# EAGLE design mainboard (EAGLE 7.0.0)
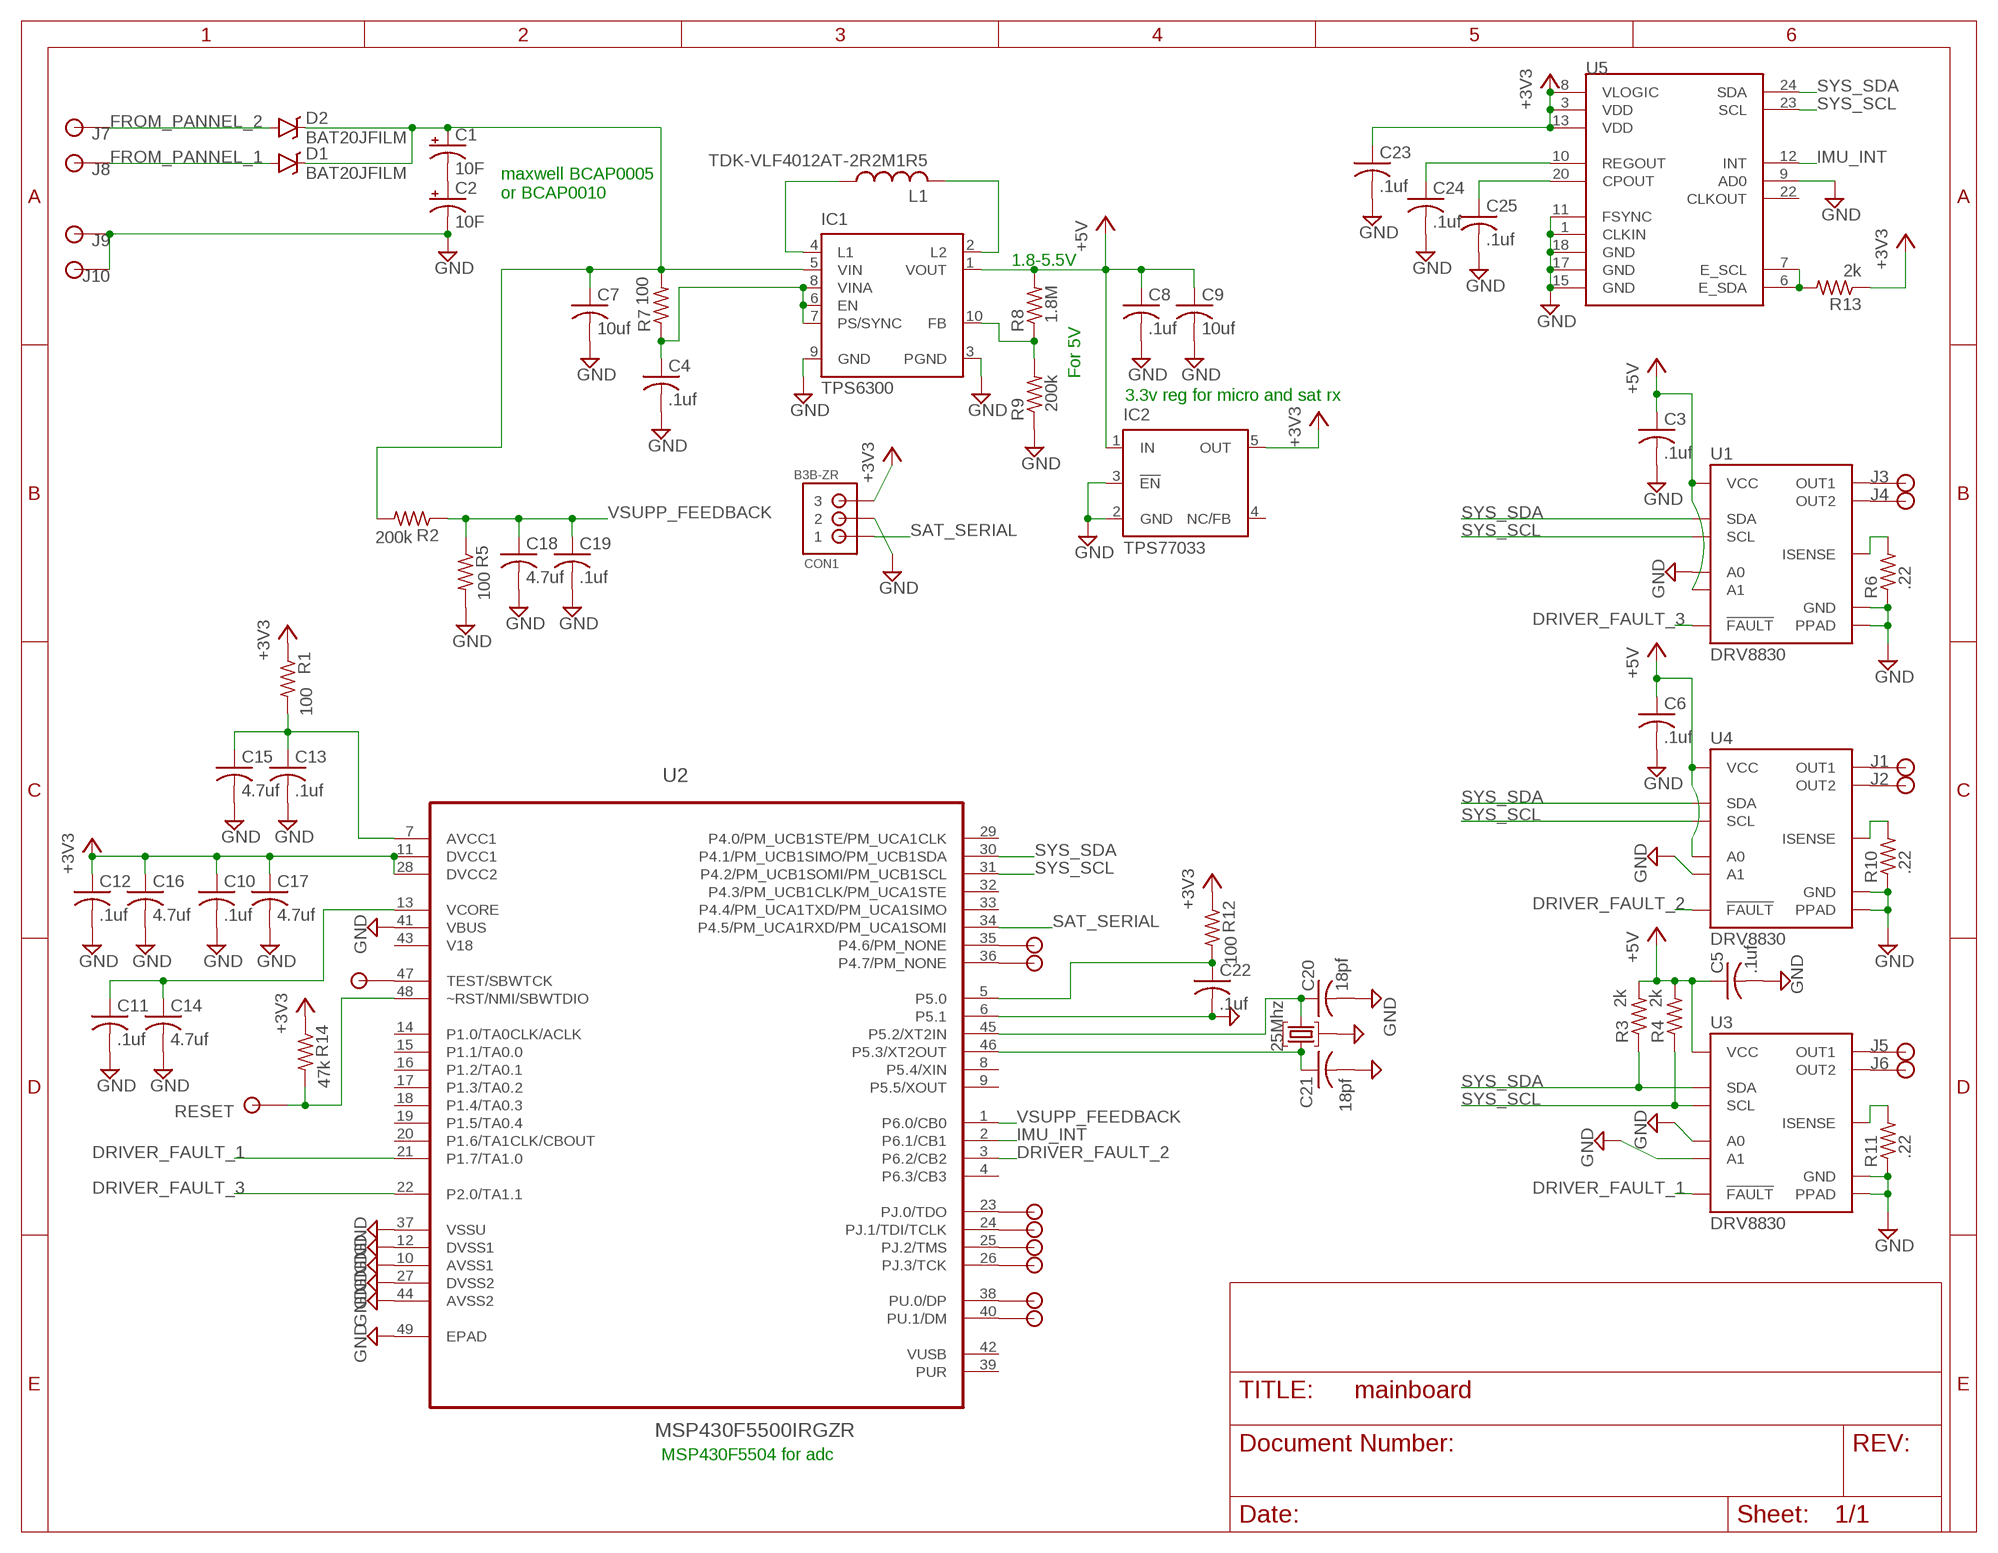
[diagram p0: schematic, sheet 1]

## Parts
C1  10F  CPOL-USE5-10.5  [E5-10,5]
C2  10F  CPOL-USE5-10.5  [E5-10,5]
C3  .1uf  C-USC0603  [C0603]
C4  .1uf  C-USC0603  [C0603]
C5  .1uf  C-USC0603  [C0603]
C6  .1uf  C-USC0603  [C0603]
C7  10uf  C-USC0603  [C0603]
C8  .1uf  C-USC0603  [C0603]
C9  10uf  C-USC0603  [C0603]
C10  .1uf  C-USC0603  [C0603]
C11  .1uf  C-USC0603  [C0603]
C12  .1uf  C-USC0603  [C0603]
C13  .1uf  C-USC0603  [C0603]
C14  4.7uf  C-USC0603  [C0603]
C15  4.7uf  C-USC0603  [C0603]
C16  4.7uf  C-USC0603  [C0603]
C17  4.7uf  C-USC0603  [C0603]
C18  4.7uf  C-USC0603  [C0603]
C19  .1uf  C-USC0603  [C0603]
C20  18pf  C-USC0603  [C0603]
C21  18pf  C-USC0603  [C0603]
C22  .1uf  C-USC0603  [C0603]
C23  .1uf  C-USC0603  [C0603]
C24  .1uf  C-USC0603  [C0603]
C25  .1uf  C-USC0603  [C0603]
CON1  B3B-ZR  [B3B-ZR]
D1  BAT20JFILM  [SOD-323]
D2  BAT20JFILM  [SOD-323]
IC1  TPS6300  [DRC-S-PVSON-N10]
IC2  TPS77033  [SOT23-DBV]
J1  2MMPAD  [2MMPAD]
J2  2MMPAD  [2MMPAD]
J3  2MMPAD  [2MMPAD]
J4  2MMPAD  [2MMPAD]
J5  2MMPAD  [2MMPAD]
J6  2MMPAD  [2MMPAD]
J7  2MMPAD  [2MMPAD]
J8  2MMPAD  [2MMPAD]
J9  2MMPAD  [2MMPAD]
J10  2MMPAD  [2MMPAD]
J11  ROUND1MM  [ROUND1MM]
J12  ROUND1MM  [ROUND1MM]
J13  ROUND1MM  [ROUND1MM]
J14  ROUND1MM  [ROUND1MM]
J15  ROUND1MM  [ROUND1MM]
J16  ROUND1MM  [ROUND1MM]
J17  ROUND1MM  [ROUND1MM]
J18  ROUND1MM  [ROUND1MM]
J19  ROUND1MM  [ROUND1MM]
J20  ROUND1MM  [ROUND1MM]
L1  TDK-VLF4012AT-2R2M1R5  [TDK-VLF4012AT-2R2M1R5]
Q1  25Mhz  25MHZ-3X2MM  [SMD-3.2X2.5]
R1  100  R-US_R0402  [R0402]
R2  200k  R-US_R0402  [R0402]
R3  2k  R-US_R0402  [R0402]
R4  2k  R-US_R0402  [R0402]
R5  100  R-US_R0402  [R0402]
R6  .22  R-US_R0402  [R0402]
R7  100  R-US_R0402  [R0402]
R8  1.8M  R-US_R0402  [R0402]
R9  200k  R-US_R0402  [R0402]
R10  .22  R-US_R0402  [R0402]
R11  .22  R-US_R0402  [R0402]
R12  100  R-US_R0402  [R0402]
R13  2k  R-US_R0402  [R0402]
R14  47k  R-US_R0402  [R0402]
U1  DRV8830  [MSOP-10-GNDPAD]
U2  MSP430F5500IRGZR  [QFN50P700X700X100-49N]
U3  DRV8830  [MSOP-10-GNDPAD]
U4  DRV8830  [MSOP-10-GNDPAD]
U5  MPU-9150QFN-24-NP  [QFN-24-NP]

## Nets
+3V3: C10.1 C12.1 C16.1 C17.1 C23.1 CON1.3 IC2.5(OUT) R1.1 R12.1 R13.1 R14.1 U2.11(DVCC1) U2.28(DVCC2) U5.3(VDD) U5.8(VLOGIC) U5.13(VDD)
+5V: C3.1 C5.1 C6.1 C8.1 C9.1 IC1.1(VOUT) IC2.1(IN) R3.2 R4.2 R8.2 U1.4(VCC) U1.8(A1) U3.4(VCC) U4.4(VCC) U4.7(A0)
DRIVER_FAULT_1: U2.21(P1.7/TA1.0) U3.6(!FAULT)
DRIVER_FAULT_2: U2.3(P6.2/CB2) U4.6(!FAULT)
DRIVER_FAULT_3: U1.6(!FAULT) U2.22(P2.0/TA1.1)
FROM_PANNEL_1: D1.A J8.P$1
FROM_PANNEL_2: D2.A J7.P$1
GND: C2.- C3.2 C4.2 C5.2 C6.2 C7.2 C8.2 C9.2 C10.2 C11.2 C12.2 C13.2 C14.2 C15.2 C16.2 C17.2 C18.2 C19.2 C20.2 C21.2 C22.2 C23.2 C24.2 C25.2 CON1.2 IC1.3(PGND) IC1.9(GND) IC2.2(GND) IC2.3(!EN) J9.P$1 J10.P$1 Q1.P$2 Q1.P$4 R5.2 R6.1 R9.1 R10.1 R11.1 U1.5(GND) U1.7(A0) U1.GND(PPAD) U2.6(P5.1) U2.10(AVSS1) U2.12(DVSS1) U2.27(DVSS2) U2.37(VSSU) U2.41(VBUS) U2.44(AVSS2) U2.49(EPAD) U3.5(GND) U3.7(A0) U3.8(A1) U3.GND(PPAD) U4.5(GND) U4.8(A1) U4.GND(PPAD) U5.1(CLKIN) U5.9(AD0) U5.11(FSYNC) U5.15(GND) U5.17(GND) U5.18(GND)
IMU_INT: U2.2(P6.1/CB1) U5.12(INT)
N$1: C1.- C2.+
N$2: C1.+ C7.1 D1.C D2.C IC1.5(VIN) R2.2 R7.2
N$3: IC1.4(L1) L1.P$1
N$4: IC1.2(L2) L1.P$2
N$5: C13.1 C15.1 R1.2 U2.7(AVCC1)
N$6: J1.P$1 U4.3(OUT1)
N$7: C11.1 C14.1 U2.13(VCORE)
N$8: C4.1 IC1.6(EN) IC1.7(PS/SYNC) IC1.8(VINA) R7.1
N$9: IC1.10(FB) R8.1 R9.2
N$10: J2.P$1 U4.1(OUT2)
N$11: J3.P$1 U1.3(OUT1)
N$12: J4.P$1 U1.1(OUT2)
N$13: J5.P$1 U3.3(OUT1)
N$14: J6.P$1 U3.1(OUT2)
N$15: C20.1 Q1.P$1 U2.45(P5.2/XT2IN)
N$16: C21.1 Q1.P$3 U2.46(P5.3/XT2OUT)
N$17: R6.2 U1.2(ISENSE)
N$18: R11.2 U3.2(ISENSE)
N$19: R10.2 U4.2(ISENSE)
N$20: C22.1 R12.2 U2.5(P5.0)
N$21: R13.2 U5.6(E_SDA) U5.7(E_SCL)
N$22: C24.1 U5.10(REGOUT)
N$23: C25.1 U5.20(CPOUT)
N$24: J11.P$1 U2.23(PJ.0/TDO)
N$25: J12.P$1 U2.24(PJ.1/TDI/TCLK)
N$26: J13.P$1 U2.25(PJ.2/TMS)
N$27: J14.P$1 U2.26(PJ.3/TCK)
N$28: J16.P$1 U2.47(TEST/SBWTCK)
N$29: J17.P$1 U2.36(P4.7/PM_NONE)
N$30: J18.P$1 U2.35(P4.6/PM_NONE)
N$31: J19.P$1 U2.38(PU.0/DP)
N$32: J20.P$1 U2.40(PU.1/DM)
RESET: J15.P$1 R14.2 U2.48(~RST/NMI/SBWTDIO)
SAT_SERIAL: CON1.1 U2.34(P4.5/PM_UCA1RXD/PM_UCA1SOMI)
SYS_SCL: R4.1 U1.10(SCL) U2.31(P4.2/PM_UCB1SOMI/PM_UCB1SCL) U3.10(SCL) U4.10(SCL) U5.23(SCL)
SYS_SDA: R3.1 U1.9(SDA) U2.30(P4.1/PM_UCB1SIMO/PM_UCB1SDA) U3.9(SDA) U4.9(SDA) U5.24(SDA)
VSUPP_FEEDBACK: C18.1 C19.1 R2.1 R5.1 U2.1(P6.0/CB0)
Unconnected: IC1.TH IC2.4(NC/FB) U2.4(P6.3/CB3) U2.8(P5.4/XIN) U2.9(P5.5/XOUT) U2.14(P1.0/TA0CLK/ACLK) U2.15(P1.1/TA0.0) U2.16(P1.2/TA0.1) U2.17(P1.3/TA0.2) U2.18(P1.4/TA0.3) U2.19(P1.5/TA0.4) U2.20(P1.6/TA1CLK/CBOUT) U2.29(P4.0/PM_UCB1STE/PM_UCA1CLK) U2.32(P4.3/PM_UCB1CLK/PM_UCA1STE) U2.33(P4.4/PM_UCA1TXD/PM_UCA1SIMO) U2.39(PUR) U2.42(VUSB) U5.22(CLKOUT)

## Notes on the sheet
- maxwell BCAP0005 
  or BCAP0010
- 1.8-5.5V
- For 5V
- 3.3v reg for micro and sat rx
- MSP430F5504 for adc

## Power pins joined to a net without a drawn wire
V18: U2.43(V18)

## Library data of the parts
C1 C2 = rcl:CPOL-US: POLARIZED CAPACITOR, American symbol
C3-C25 = rcl:C-US: CAPACITOR, American symbol
CON1 = jst:B3B-ZR: JST-ZH Connector 3 pol, 1.5mm pitch Package: B3B-ZR Source: http://www.jst-mfg.com/product/pdf/eng/eZH.pdf
D1 D2 = SparkFun-DiscreteSemi:BAT20JFILM: 23V, 1A Schottky diode, SOD-323 package; PROD_ID: DIO-11623
IC1 = texas:TPS6300*: HIGH EFFICIENT SINGLE INDUCTOR BUCK-BOOST CONVERTER WITH 1.8-A SWITCHES Source: http://focus.ti.com/lit/ds/symlink/tps63001.pdf; MPN: TPS63000DRCTG4; OC_FARNELL: 1511852; OC_NEWARK: 59M7217
IC2 = texas:TPS770*: ULTRALOW-POWER 50-mA LOW-DROPOUT LINEAR REGULATORS 50-mA Low-Dropout Regulator Source: http://focus.ti.com/lit/ds/symlink/tps77001.pdf; MF: TEXAS INSTRUMENTS; MPN: TPS77033DBVT; OC_FARNELL: 8461570; OC_NEWARK: 77C1187
J1-J10 = connectors:2MMPAD
J11-J20 = connectors:ROUND1MM
L1 = passives:TDK-VLF4012AT-2R2M1R5; MFG: TDK; MFN: VLF4012AT-2R2M1R5
Q1 = crystals:25MHZ-3X2MM
R1-R14 = rcl:R-US_: RESISTOR, American symbol
U1 U3 U4 = SparkFun-PowerIC:DRV8830: DRV8830 I2C DC Motor Driver TSSOP-10 with exposed power pad 1A current limit, 2.75V to 6.8V; PROD_ID: IC-11646
U2 = Texas Instruments_By_element14_Batch_1:MSP430F5500IRGZR: MIXED SIGNAL MICROCONTROLLER; MPN: MSP430F5500IRGZR; OC_FARNELL: 1972383; OC_NEWARK: 27T6606; PACKAGE: VQFN-48; SUPPLIER: TEXAS INSTRUMENTS
U5 = SparkFun-Sensors:MPU-9150: 9DOF (3mag, 3accel, 3rotat). I2C interface.

## Board
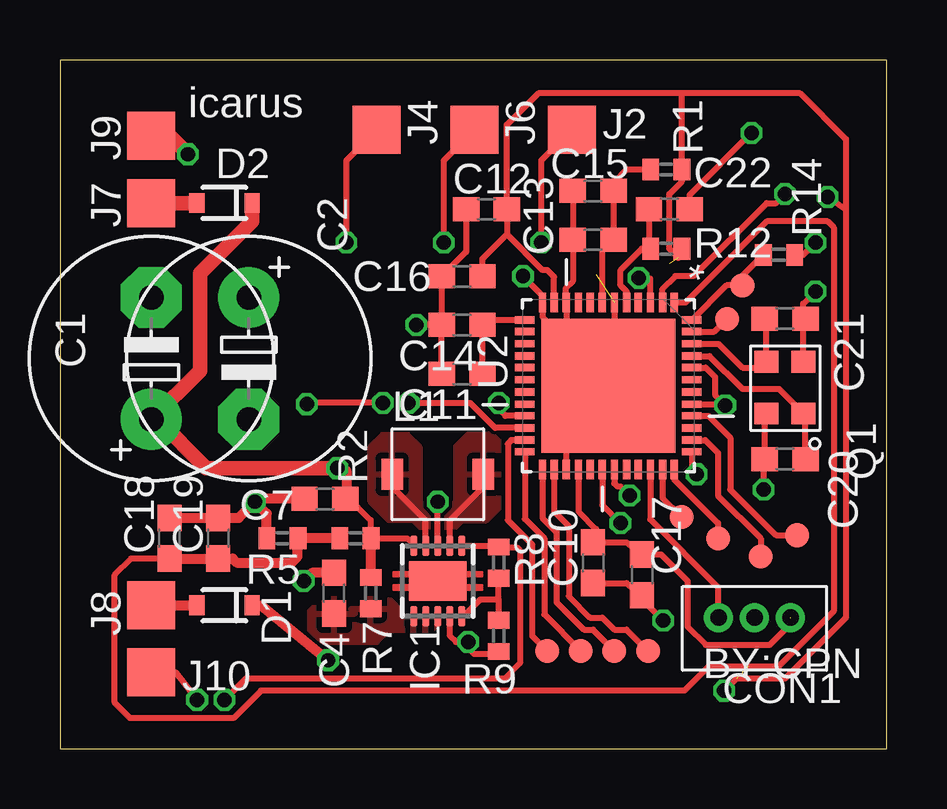
[diagram p1: board, top side]
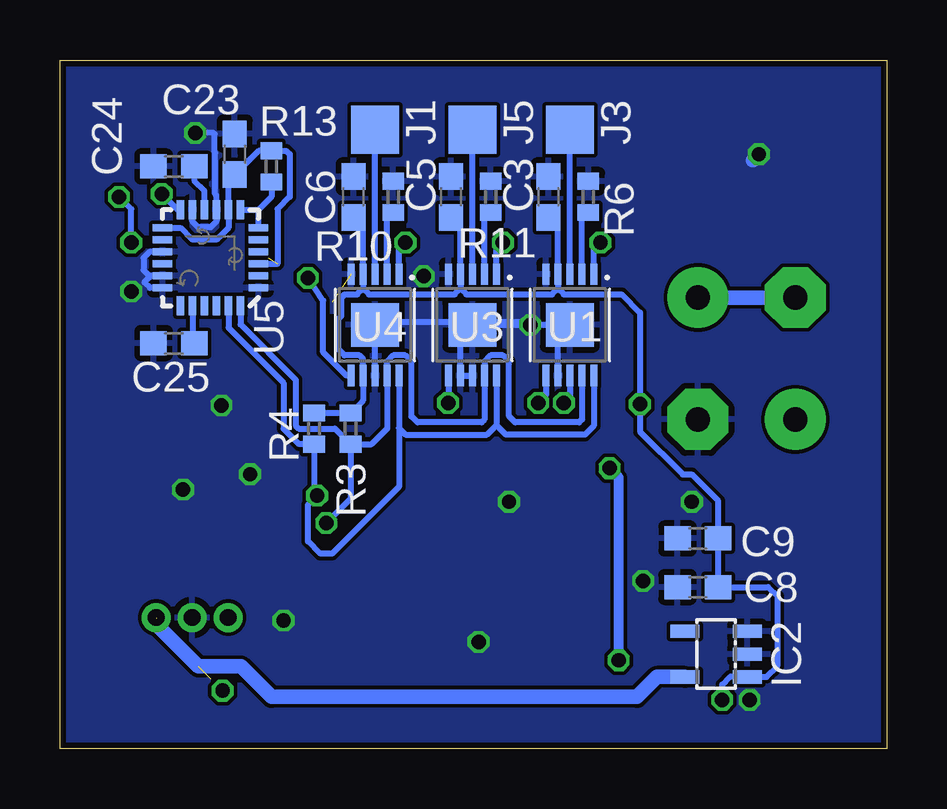
[diagram p2: board, bottom side, seen from below]

Size 34.47 x 28.69 mm. Coordinates in mm from the lower left corner, seen from the top.
Outline: 0,0 34.47,0 34.47,28.69 0,28.69 0,0
Copper layers (1*16): Top 0.035mm / dielectric 1.5mm / Bottom 0.035mm
Design rules "SeeedStudio_2layer_DRU_no_angle_20140221": minimum track width 6mil, minimum drill 12mil, track to track 6mil, track to pad 6mil, pad to pad 6mil, via to via 6mil, smd to smd 0mil, copper to edge 10mil, drill to drill 10mil, minimum pad ring 10mil, minimum via ring 6mil, stop-mask expansion 2mil, vias tented up to drill 100mil, thermal gap 10mil

### Footprints (pad centres in the part's own frame; a part is rotated, then mirrored left to right if it is on the bottom)
E5-10,5 = drill 1.016 pad 2.54: + -2.54,0 | drill 1.016 pad 2.54 octagon: - 2.54,0
C0603 = smd 1.1 x 1: 1 -0.85,0; 2 0.85,0
B3B-ZR = drill 0.7 pad 1.1: 1 -1.5,0; 2 0,0; 3 1.5,0
SOD-323 = smd 0.63 x 0.83: A 1.15,0; C -1.15,0
DRC-S-PVSON-N10 = smd 0.28 x 0.85: 1 -1,-1.475; 2 -0.5,-1.475; 3 0,-1.475; 4 0.5,-1.475; 5 1,-1.475; 6 1,1.475; 7 0.5,1.475; 8 0,1.475; 9 -0.5,1.475; 10 -1,1.475 | smd 2.4 x 1.65: TH 0,0
SOT23-DBV = smd 0.55 x 1.2: 1 -0.95,-1.3; 2 0,-1.3; 3 0.95,-1.3; 4 0.95,1.3; 5 -0.95,1.3
2MMPAD = smd 2 x 2: P$1 0,0
ROUND1MM = smd 1 x 1: P$1 0,0
TDK-VLF4012AT-2R2M1R5 = smd 0.9 x 1.3: P$1 -1.9,0; P$2 1.9,0
SMD-3.2X2.5 = smd 0.9 x 1: P$1 0,0; P$2 2.15,0; P$3 2.15,1.55; P$4 0,1.55
R0402 = smd 0.7 x 0.9: 1 -0.65,0; 2 0.65,0
MSOP-10-GNDPAD = smd 0.305 x 0.889: 1 -1,-2.11; 2 -0.5,-2.11; 3 0,-2.11; 4 0.5,-2.11; 5 1,-2.11; 6 1,2.11; 7 0.5,2.11; 8 0,2.11; 9 -0.5,2.11; 10 -1,2.11 | smd 2 x 1.8: GND 0,0
QFN50P700X700X100-49N = smd 0.813 x 0.305: 1 -3.48,2.743; 2 -3.48,2.261; 3 -3.48,1.753; 4 -3.48,1.245; 5 -3.48,0.762; 6 -3.48,0.254; 7 -3.48,-0.254; 8 -3.48,-0.762; 9 -3.48,-1.245; 10 -3.48,-1.753; 11 -3.48,-2.261; 12 -3.48,-2.743; 25 3.48,-2.743; 26 3.48,-2.261; 27 3.48,-1.753; 28 3.48,-1.245; 29 3.48,-0.762; 30 3.48,-0.254; 31 3.48,0.254; 32 3.48,0.762; 33 3.48,1.245; 34 3.48,1.753; 35 3.48,2.261; 36 3.48,2.743 | smd 0.305 x 0.813: 13 -2.743,-3.48; 14 -2.261,-3.48; 15 -1.753,-3.48; 16 -1.245,-3.48; 17 -0.762,-3.48; 18 -0.254,-3.48; 19 0.254,-3.48; 20 0.762,-3.48; 21 1.245,-3.48; 22 1.753,-3.48; 23 2.261,-3.48; 24 2.743,-3.48; 37 2.743,3.48; 38 2.261,3.48; 39 1.753,3.48; 40 1.245,3.48; 41 0.762,3.48; 42 0.254,3.48; 43 -0.254,3.48; 44 -0.762,3.48; 45 -1.245,3.48; 46 -1.753,3.48; 47 -2.261,3.48; 48 -2.743,3.48 | smd 5.588 x 5.588: 49 0,0
QFN-24-NP = smd 0.8 x 0.3: 1 -2,1.25; 2 -2,0.75; 3 -2,0.25; 4 -2,-0.25; 5 -2,-0.75; 6 -2,-1.25; 13 2,-1.25; 14 2,-0.75; 15 2,-0.25; 16 2,0.25; 17 2,0.75; 18 2,1.25 | smd 0.3 x 0.8: 7 -1.25,-2; 8 -0.75,-2; 9 -0.25,-2; 10 0.25,-2; 11 0.75,-2; 12 1.25,-2; 19 1.25,2; 20 0.75,2; 21 0.25,2; 22 -0.25,2; 23 -0.75,2; 24 -1.25,2

### Placement (x,y rotation side)
C1  3.81,16.26 90 top
C2  7.87,16.26 270 top
C3  14.1,22.99 90 bottom
C4  11.43,6.48 90 top
C5  18.16,22.99 90 bottom
C6  22.23,22.99 90 bottom
C7  11.05,10.41 180 top
C8  7.87,6.73 180 bottom
C9  7.87,8.76 180 bottom
C10  22.23,7.75 270 top
C11  16.76,15.62 180 top
C12  17.78,22.48 180 top
C13  22.23,21.21 180 top
C14  16.76,17.65 180 top
C15  22.23,23.24 180 top
C16  16.76,19.68 180 top
C17  24.26,7.24 270 top
C18  4.57,8.76 90 top
C19  6.6,8.76 90 top
C20  30.23,12.06 180 top
C21  30.23,17.91 0 top
C22  25.4,22.48 0 top
C23  27.18,24.77 90 bottom
C24  29.72,24.26 180 bottom
C25  29.72,16.89 180 bottom
CON1  28.96,5.46 0 top
D1  6.86,5.97 180 top
D2  6.86,22.73 180 top
IC1  15.75,6.99 180 top
IC2  7.11,3.94 90 bottom
J1  21.34,25.78 270 bottom
J2  21.34,25.78 270 top
J3  13.21,25.78 270 bottom
J4  13.21,25.78 270 top
J5  17.27,25.78 270 bottom
J6  17.27,25.78 270 top
J7  3.81,22.73 270 top
J8  3.81,5.97 90 top
J9  3.81,25.53 0 top
J10  3.81,3.17 90 top
J11  20.32,4.06 0 top
J12  21.72,4.06 0 top
J13  23.11,4.06 0 top
J14  24.51,4.06 0 top
J15  28.45,19.3 0 top
J16  27.81,17.91 0 top
J17  27.43,8.76 0 top
J18  25.91,9.65 0 top
J19  29.21,8 0 top
J20  30.73,8.89 0 top
L1  15.75,11.43 0 top
Q1  30.99,13.97 90 top
R1  25.27,24.13 180 top
R2  12.32,8.76 0 top
R3  22.35,13.34 90 bottom
R4  23.88,13.34 90 bottom
R5  9.27,8.76 180 top
R6  12.45,22.99 270 bottom
R7  12.95,6.48 90 top
R8  18.29,7.75 90 top
R9  18.29,4.7 90 top
R10  20.57,22.99 270 bottom
R11  16.51,22.99 270 bottom
R12  25.27,20.83 180 top
R13  25.65,24.26 270 bottom
R14  29.97,20.57 180 top
U1  13.21,17.65 180 bottom
U2  22.86,15.11 270 top
U3  17.27,17.65 180 bottom
U4  21.34,17.65 180 bottom
U5  28.19,20.45 180 bottom

### Tracks (layer width: path | path; a pad name or v marks a point on that pad's centre or on a via)
+3V3  (via drill 0.6)  (3 unrouted)
  Top 0.254: U2.11 20.6,19.66 20.32,19.94 20.12,19.94 18.63,21.43 | 32.77,22.48 32.77,25.4 30.86,27.3 25.91,27.3 | 32.77,22.48 32.77,5.46 30.23,2.92 28.19,2.92 v27.69,2.41 | R12.1 25.78,20.45 25.4,20.83 25.4,23.1 25.92,23.62 R1.1 25.92,27.29 25.91,27.3 | 18.63,21.43 C12.1 18.63,26 19.94,27.3 25.91,27.3 | C16.1 17.61,20.41 18.63,21.43 | U2.28 21.61,9.88 22.35,9.14 C10.1 23.62,8.6 C17.1 25.06,8.09 26.16,6.99 26.16,5.08 26.92,4.32 29.59,4.32 30.23,4.95 30.23,5.23 CON1.3 | v32,22.99 32.77,22.48 | R14.1 30.99,20.57 v31.5,21.08
  Bottom 0.254: U5.13 29.44,21.7 28.96,21.21 27.94,21.21 27.44,21.7 U5.8 27.44,23.65 C23.1 26.19,24.91 R13.1 25.03,24.91 24.89,24.77 24.89,22.99 25.4,22.48 25.4,20.2 U5.3 | v31.5,21.08 31.5,22.48 v32,22.99
  Bottom 0.61: IC2.5 9.59,2.99 10.41,2.16 25.65,2.16 26.92,3.43 28.7,3.43 30.43,5.16 30.43,5.44
+5V  (via drill 0.6)
  Top 0.254: 18.33,8.44 R8.2 18.23,8.46 IC1.1 18.21,8.46 18.29,8.38 19.05,8.38 19.18,8.26 19.18,3.56 18.54,2.92 7.75,2.92 v6.86,2.03 | v13.46,14.4 10.34,14.4 v10.29,14.35
  Bottom 0.254: 13.71,19.17 U1.4 13.71,21.75 C3.1 | 13.71,19.17 13.46,18.92 11.05,18.92 10.29,18.16 v10.29,14.35 10.29,13.21 8.51,11.43 8.13,11.43 7.02,10.33 C9.1 C8.1 4.95,6.73 4.57,6.35 4.57,3.43 5.01,2.99 IC2.1 6.54,2.99 6.86,2.67 v6.86,2.03 | 17.77,19.17 U3.4 17.77,21.75 C5.1 | 17.77,19.17 17.53,18.92 13.95,18.92 13.71,19.17 | 21.84,19.17 U4.4 21.84,21.75 C6.1 | 21.84,19.17 21.59,18.92 18.02,18.92 17.77,19.17 | R4.2 R3.2 21.84,14.5 U4.7 21.84,16.25 21.97,16.38 22.61,16.38 22.86,16.64 22.86,17.91 22.73,18.03 22.73,18.8 22.61,18.92 22.08,18.92 21.84,19.17 | U1.8 13.21,14.66 v13.46,14.4
DRIVER_FAULT_1  (via drill 0.6)
  Top 0.254: U2.21 18.57,13.87 18.29,14.15 v18.29,14.4
  Bottom 0.254: U3.6 18.27,14.42 v18.29,14.4
DRIVER_FAULT_2  (via drill 0.6)
  Top 0.254: U2.3 24.61,19.58 v24.13,19.61
  Bottom 0.254: U4.6 22.53,15.54 23.5,16.51 23.5,18.67 v24.13,19.61
DRIVER_FAULT_3  (via drill 0.6)
  Top 0.254: v14.53,14.4 17.09,14.4 18.14,13.36 U2.22
  Bottom 0.254: U1.6 14.21,14.72 v14.53,14.4
FROM_PANNEL_1
  Top 0.406: J8.P$1 D1.A
FROM_PANNEL_2
  Top 0.61: J7.P$1 D2.A
GND  (via drill 0.6)  (1 unrouted)
  Top 0.254: IC1.3 v15.75,10.29 | R9.1 18.29,3.94 17.27,3.94 17.02,4.19 v17.02,4.45 16.51,4.45 16.25,4.71 IC1.9 | J10.P$1 4.83,3.17 v5.71,2.03 | v19.3,19.68 20.12,18.87 U2.12 20.12,17.98 20.57,17.53 21.21,17.53 U4.GND 21.11,17.88 U2.10 21.08,18.62 21.08,19.18 21.38,19.47 C13.2 C15.2 | C22.2 26.25,23.07 v28.83,25.65 | C14.2 v14.86,17.65 | C11.2 C14.2 | C14.2 C16.2 16.93,20.7 C12.2 | U2.6 23.11,15.75 | 23.11,15.75 23.11,15.37 U2.49 | U2.27 21.11,13.74 23.11,15.75 | C10.2 23.62,6.9 C17.2 24.26,6.22 v25.15,5.33 | C21.2 30.99,17.82 Q1.P$2 30.99,18.54 v31.5,19.05 | C20.2 29.38,13.91 Q1.P$4 | 29.12,12.32 C20.2 | v29.34,10.79 29.34,12.03 C20.2 | U2.37 26.34,11.63 v26.54,11.43 | U2.41 27.69,14.35 v27.74,14.3 27.3,14.73 27.3,15.49 26.92,15.88 U2.44
  Top 0.406: R5.2 8.62,9.79 v8.13,10.29 | v8.13,10.29 7.45,9.61 C19.2 C18.2 | C4.2 10.5,7.33 v10.16,6.99 | C7.2 8.26,10.41 v8.13,10.29
  Top 0.61: J9.P$1 4.57,25.53 v5.33,24.77
  Bottom 0.254: U5.15 30.74,20.7 30.99,20.45 30.99,19.94 30.75,19.7 | 30.75,19.7 U5.17 30.72,19.7 | U5.18 30.71,19.2 30.95,19.43 30.75,19.63 30.75,19.7 | v15.75,10.29 15.49,10.29 | C8.2 8.72,6.82 | C9.2 8.72,8.68 | U5.11 28.96,22.43 28.96,21.97 28.7,21.72 28.19,21.72 27.94,21.97 U5.9 27.94,23.04 27.99,23.09 27.99,24.82 28.02,24.84 28.02,25.6 28.07,25.65 v28.83,25.65 28.83,25.91 | U1.7 13.71,17.15 U1.GND v14.86,17.65 | U3.8 U3.7 17.77,17.15 U3.GND v14.86,17.65 | U4.8 21.34,17.14 20.95,17.14 20.32,17.78 14.99,17.78 v14.86,17.65
  Bottom 0.406: v8.13,10.29 8.13,10.54 | v10.16,6.99 10.16,7.24
  Bottom 0.61: v5.33,24.77 5.59,24.51
  pour Bottom: 0,28.57 0,0 34.42,0 34.42,28.7 0,28.7
IMU_INT  (via drill 0.6)
  Top 0.254: U2.2 25.12,19.15 25.65,19.68 26.42,19.68 29.46,22.73 29.84,22.73 v30.23,23.11
  Bottom 0.254: U5.12 29.56,22.45 v30.23,23.11
N$1
  Bottom 0.61: C1.- C2.+
N$2  (via drill 0.6)
  Top 0.254: C7.1 11.94,10.54 12.95,9.53 12.95,8.76 R2.2 14.48,8.76 14.73,8.51 IC1.5
  Top 0.406: 12.95,8.76 R7.2 | D1.C 8.38,5.97 v11.18,3.68 | v11.56,11.68 11.81,11.68 11.94,11.56 11.94,10.45 C7.1
  Top 0.61: v11.56,11.68 6.1,11.68 4.06,13.72 C1.+ 5.84,15.75 5.84,19.81 8.01,21.98 D2.C
  Bottom 0.406: v11.18,3.68 11.18,11.3 v11.56,11.68
N$3
  Top 0.254: IC1.4 15.24,8.51 15.24,9.53 13.97,10.79 13.97,11.3 L1.P$1
  pour Top: 15.24,9.02 14.73,9.53 13.72,9.53 12.95,10.29 12.95,12.57 13.46,13.08 14.48,13.08 14.99,12.57 14.99,10.29 15.49,9.78 15.49,9.27
N$4
  Top 0.254: IC1.2 16.26,8.51 16.26,9.53 17.53,10.79 17.53,11.3 L1.P$2
  pour Top: 16.26,9.02 16.76,9.53 17.78,9.53 18.54,10.29 18.54,12.57 18.03,13.08 17.02,13.08 16.51,12.57 16.51,10.29 16,9.78 16,9.27
N$5
  Top 0.254: U2.7 22.61,20.74 C13.1 C15.1 23.1,22.99 23.1,23.61 23.62,24.13 R1.2
N$6
  Bottom 0.254: U4.3 J1.P$1
N$7
  Top 0.254: U2.13 17.92,17.86 C14.1 C11.1
N$8
  pour Top: 15.75,5.21 15.75,5.71 14.22,5.71 13.72,6.22 10.92,6.22 10.41,5.71 10.41,4.95 10.92,4.45 13.21,4.45 13.72,4.95 15.49,4.95
N$9
  Top 0.254: 18.29,6.22 17.53,6.22 16.76,5.46 IC1.10 | 18.29,6.22 R9.2 | 18.29,6.22 R8.1
N$10  (via drill 0.6)
  Top 0.254: v20.07,21.08 20.07,24.51 J2.P$1
  Bottom 0.254: U4.1 20.34,20.81 v20.07,21.08
N$11
  Bottom 0.254: U1.3 J3.P$1
N$12  (via drill 0.6)
  Top 0.254: v11.94,21.08 11.94,24.51 J4.P$1
  Bottom 0.254: U1.1 12.21,20.81 v11.94,21.08
N$13
  Bottom 0.254: U3.3 J5.P$1
N$14  (via drill 0.6)
  Top 0.254: v16,21.08 16,24.51 J6.P$1
  Bottom 0.254: U3.1 16.27,20.81 v16,21.08
N$15
  Top 0.254: U2.45 27.08,16.36 28.45,14.99 29.97,14.99 Q1.P$1 31.08,13.88 C20.1
N$16
  Top 0.254: C21.1 29.44,17.84 Q1.P$3 29.19,15.88 28.45,15.88 27.46,16.87 U2.46
N$17
  Bottom 0.254: U1.2 12.71,22.07 R6.2
N$18
  Bottom 0.254: U3.2 16.77,22.07 R11.2
N$19
  Bottom 0.254: U4.2 20.84,22.07 R10.2
N$20
  Top 0.254: C22.1 24.55,20.52 R12.2 24.26,20.83 23.37,19.94 23.37,19.3 23.62,19.05 U2.5
N$21
  Bottom 0.254: R13.2 25.65,22.99 26.19,22.45 | U5.6 26.19,22.45 | U5.7 26.19,22.45
N$22
  Bottom 0.254: U5.10 28.44,23.24 28.87,23.66 C24.1
N$23
  Bottom 0.254: U5.20 28.94,16.97 C25.1
N$24
  Top 0.254: U2.23 18.82,12.85 18.67,12.7 18.67,9.53 19.68,8.51 19.68,4.7 J11.P$1
N$25
  Top 0.254: U2.24 19.38,9.58 20.19,8.76 20.19,5.59 J12.P$1
N$26
  Top 0.254: U2.25 20.12,9.6 20.7,9.02 20.7,6.1 21.84,4.95 22.23,4.95 J13.P$1
N$27
  Top 0.254: U2.26 20.6,9.88 21.21,9.27 21.21,6.35 22.1,5.46 22.61,5.46 23.11,4.95 23.62,4.95 J14.P$1
N$28
  Top 0.254: U2.47 27.28,17.37 J16.P$1
N$29
  Top 0.254: U2.36 25.6,11.23 27.43,9.4 J17.P$1
N$30
  Top 0.254: U2.35 25.12,10.44 J18.P$1
N$31
  Top 0.254: U2.38 26.9,12.85 27.43,12.32 27.43,10.54 29.21,8.76 J19.P$1
N$32
  Top 0.254: U2.40 27.03,13.87 27.94,12.95 27.94,10.79 29.84,8.89 J20.P$1
RESET
  Top 0.254: U2.48 27.79,19.3 J15.P$1 28.45,19.7 R14.2
SAT_SERIAL
  Top 0.254: U2.34 24.61,9.55 27.43,6.73 27.43,5.49 CON1.1
SYS_SCL  (via drill 0.6)
  Top 0.254: U2.31 23.11,11.05 23.24,10.92 23.37,10.92 v23.75,10.54
  Bottom 0.254: 20.32,15.53 U4.10 20.34,13.35 | U5.23 27.44,17.54 25.15,15.24 25.15,13.34 24.5,12.69 R4.1 | R4.1 23.88,10.67 v23.75,10.54 24.13,10.16 24.13,8.64 23.62,8.13 23.11,8.13 20.34,10.91 20.34,13.35 | R4.1 23.76,12.69 | U1.10 12.21,13.45 12.57,13.08 15.88,13.08 16.26,13.46 | 16.26,13.46 16.29,13.46 16.67,13.08 20.07,13.08 20.34,13.35 | U3.10 16.27,13.48 16.26,13.46
SYS_SDA  (via drill 0.6)
  Top 0.254: U2.30 22.61,10.16 v23.37,9.4
  Bottom 0.254: U5.24 26.94,17.67 24.64,15.37 24.64,13.46 24.51,13.34 23,13.34 R3.1 | U1.9 12.7,15.55 12.7,13.72 12.83,13.59 15.49,13.59 15.75,13.84 15.75,16.13 16,16.38 16.51,16.38 16.76,16.13 16.76,15.55 U3.9 16.77,13.71 16.89,13.59 19.56,13.59 19.81,13.84 19.81,16.13 20.07,16.38 20.57,16.38 20.84,16.12 U4.9 20.83,15.54 20.83,13.34 21.48,12.69 R3.1 | v23.37,9.4 22.35,10.41 R3.1
VSUPP_FEEDBACK
  Top 0.254: C18.1 2.96,7.91 2.29,7.24 2.29,1.91 2.92,1.27 7.24,1.27 8.38,2.41 26.04,2.41 27.05,3.43 29.97,3.43 32.26,5.71 32.26,21.72 32,21.97 29.46,21.97 26.09,18.59 U2.1
  Top 0.406: R2.1 R5.1 9.91,8.75 9.91,8 9.65,7.75 7.37,7.75 7.2,7.91 C19.1 C18.1

### Text on the board
tPlace: icarus | BY:CPN